# Altium schematic sheet Connector.SchDoc: Connector
size A4; CheckedBy: Nico Bieberich; Author: Nico Bieberich; Organization: Baltic Racing; Address1: Zur Schwedenschanze 15; Address2: Haus 18; Address3: 18435 Stralsund; Revision: xx.xx; SheetNumber: 6; SheetTotal: 6; Rules: LVS
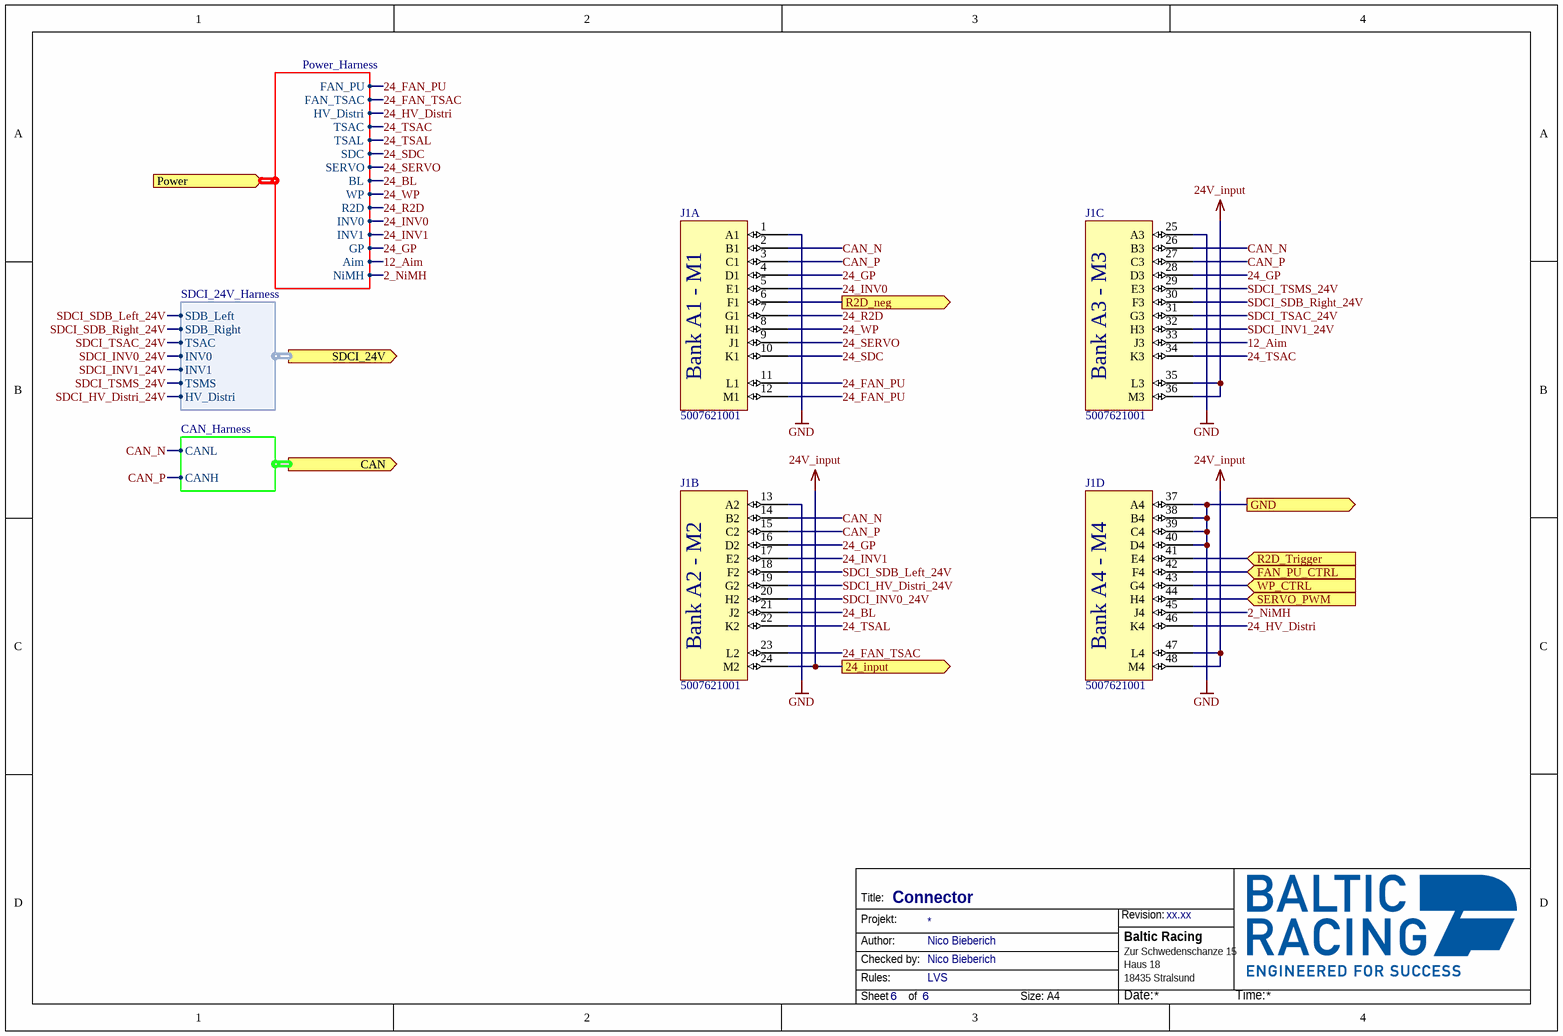
[diagram p0: Connector.SchDoc]

## Parts
J1  5007621001  [5007621001]  (parts A,B,C,D of 4)

## Ports
24_input (out), CAN (out, harness CAN_Harness), FAN_PU_CTRL (in), GND (out), Power (in, harness Power_Harness), R2D_neg (out), R2D_Trigger (in), SDCI_24V (out, harness SDCI_24V_Harness), SERVO_PWM (in), WP_CTRL (in)

## Harnesses
SDCI_24V_Harness: SDB_Left, SDB_Right, TSAC, INV0, INV1, TSMS, HV_Distri
CAN_Harness: CANL, CANH
Power_Harness: GP, HV_Distri, BL, SDC, FAN_TSAC, FAN_PU, WP, TSAL, TSAC, INV0, INV1, Aim, NiMH, SERVO, R2D

## Nets
24V_input: J1.24(M2) J1.35(L3) J1.36(M3) J1.47(L4) J1.48(M4) ; port 24_input
GND: J1.1(A1) J1.13(A2) J1.25(A3) J1.37(A4) J1.38(B4) J1.39(C4) J1.40(D4) ; port GND
2_NiMH: J1.45(J4) ; port Power.NiMH
12_Aim: J1.33(J3) ; port Power.Aim
24_BL: J1.21(J2) ; port Power.BL
24_FAN_PU: J1.11(L1) J1.12(M1) ; port Power.FAN_PU
24_FAN_TSAC: J1.23(L2) ; port Power.FAN_TSAC
24_GP: J1.4(D1) J1.16(D2) J1.28(D3) ; port Power.GP
24_HV_Distri: J1.46(K4) ; port Power.HV_Distri
24_INV0: J1.5(E1) ; port Power.INV0
24_INV1: J1.17(E2) ; port Power.INV1
24_R2D: J1.7(G1) ; port Power.R2D
24_SDC: J1.10(K1) ; port Power.SDC
24_SERVO: J1.9(J1) ; port Power.SERVO
24_TSAC: J1.34(K3) ; port Power.TSAC
24_TSAL: J1.22(K2) ; port Power.TSAL
24_WP: J1.8(H1) ; port Power.WP
CAN_N: J1.2(B1) J1.14(B2) J1.26(B3) ; port CAN.CANL
CAN_P: J1.3(C1) J1.15(C2) J1.27(C3) ; port CAN.CANH
FAN_PU_CTRL: J1.42(F4) ; port FAN_PU_CTRL
R2D_neg: J1.6(F1) ; port R2D_neg
R2D_Trigger: J1.41(E4) ; port R2D_Trigger
SDCI_HV_Distri_24V: J1.19(G2) ; port SDCI_24V.HV_Distri
SDCI_INV0_24V: J1.20(H2) ; port SDCI_24V.INV0
SDCI_INV1_24V: J1.32(H3) ; port SDCI_24V.INV1
SDCI_SDB_Left_24V: J1.18(F2) ; port SDCI_24V.SDB_Left
SDCI_SDB_Right_24V: J1.30(F3) ; port SDCI_24V.SDB_Right
SDCI_TSAC_24V: J1.31(G3) ; port SDCI_24V.TSAC
SDCI_TSMS_24V: J1.29(E3) ; port SDCI_24V.TSMS
SERVO_PWM: J1.44(H4) ; port SERVO_PWM
WP_CTRL: J1.43(G4) ; port WP_CTRL

## Notes on the sheet
- Title:
- Projekt:
- Revision:
- Author:
- Rules:
- Checked by:
- Sheet
- of
- Size:
- A4
- Date:
- Time:
- (in symbol 5007621001, part A) Bank A1 - M1
- (in symbol 5007621001, part B) Bank A2 - M2
- (in symbol 5007621001, part C) Bank A3 - M3
- (in symbol 5007621001, part D) Bank A4 - M4

## Library data of the parts
J1 = 5007621001: Molex 5007621001 / 2.50mm, 3.50mm, 3.70mm CMC Header, Sealed, Right-Angle, 48 Circuits, Black; ComponentLink1Description: Molex; ComponentLink1URL: https://www.molex.com/en-us/products/part-detail/5007621001